# Altium project Servo-Driver.PrjPcb
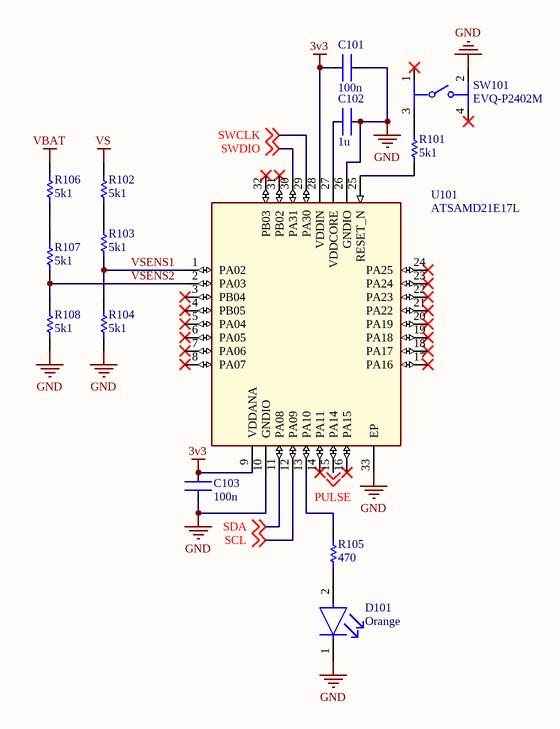
[diagram p0: SAMD21.SchDoc]
3 sheets, 29 parts. Net scope: global (net labels, ports and power ports of the same name join across sheets).
Board file: Main.PcbDoc
Sheets:
  SAMD21.SchDoc
  Power.SchDoc
  Ports.SchDoc

## Sheet SAMD21.SchDoc
size A3; SheetNumber: 1; SheetTotal: 3

### Parts
C101  100n  [FP-GCM155-0_05-MFG]
C102  1u  [FP-GRM155-0_1-MFG]
C103  100n  [FP-GCM155-0_05-MFG]
D101  Orange  [FP-SML-P1-MFG]
R101  5k1  [RESC1005X04N]
R102  5k1  [RESC1005X04N]
R103  5k1  [RESC1005X04N]
R104  5k1  [RESC1005X04N]
R105  470  [RESC1005X04N]
R106  5k1  [RESC1005X04N]
R107  5k1  [RESC1005X04N]
R108  5k1  [RESC1005X04N]
SW101  EVQ-P2402M  [EVQ-P2402M]
U101  ATSAMD21E17L  [QFN50P500X500X100_HS-33L]

### Nets
3v3: C101.1 C103.2 U101.9(VDDANA) U101.28(VDDIN)
GND: C101.2 C102.2 C103.1 D101.1(C) R104.1 R108.1 SW101.2 U101.10(GNDIO) U101.26(GNDIO) U101.33(EP)
VBAT: R106.2
VS: R102.2
PULSE: U101.15(PA14) ; off-sheet PULSE
SCL: U101.12(PA09) ; off-sheet SCL
SDA: U101.11(PA08) ; off-sheet SDA
SWCLK: U101.29(PA30) ; off-sheet SWCLK
SWDIO: U101.30(PA31) ; off-sheet SWDIO
VSENS1: R103.1 R104.2 U101.1(PA02)
VSENS2: R107.1 R108.2 U101.2(PA03)
NetC102_1: C102.1 U101.27(VDDCORE)
NetD101_2: D101.2(A) R105.2
NetR101_1: R101.1 SW101.3
NetR101_2: R101.2 U101.25(RESET_N)
NetR102_1: R102.1 R103.2
NetR105_1: R105.1 U101.13(PA10)
NetR106_1: R106.1 R107.2

Not connected (* = marked no-connect by the designer): SW101 1* 4*; U101 3(PB04)* 4(PB05)* 5(PA04)* 6(PA05)* 7(PA06)* 8(PA07)* 14(PA11)* 16(PA15)* 17(PA16)* 18(PA17)* 19(PA18)* 20(PA19)* 21(PA22)* 22(PA23)* 23(PA24)* 24(PA25)* 31(PB02)* 32(PB03)*

### Library data of the parts
C101 C103 = GCM155R71H104KE02J: Ceramic Capacitor for Automotive 100nF ±10% 50VDC X7R 0402 Paper T/R; Voltage Rating (DC): 50V; Case Code (Metric): 1005; Dielectric: X7R; Capacitance: 100nF; Packaging: Tape and Reel; Min Operating Temperature: -55°C; Length: 0.039inch; Thickness: 0.022inch; Height: 0.5mm; Mount: Surface Mount; Termination: SMD/SMT; Voltage Rating: 50V; Package Quantity: 50000; Width: 0.02inch; Case/Package: 0402; Case Code (Imperial): 0402; Ratings: AEC-Q200; Max Operating Temperature: 125°C; Tolerance: 10%; Weight: 0.000212oz; Supplier 1: Digi-Key; Supplier Part Number 1: 490-14514-1-ND
C102 = GRM155R61H105ME05D: Chip Multilayer Ceramic Capacitors for General Purpose, 0402, 1.0uF, X5R, 15%, 20%, 50V; Supplier 1: Digi-Key; Supplier Part Number 1: 490-GRM155R61H105ME05DTR-ND
D101 = SML-P11DTT86R: LED ORANGE CLEAR 1006 SMD; Manufacturer: Rohm; Forward Current: 1mA; Wavelength: 605nm; Reverse Voltage: 5V; Power Dissipation: 52mW; Led Orientation: Top View; Luminous Intensity: 7.3mcd; Forward Voltage: 1.9V; Mouser Description: LED Uni-Color Orange 2-Pin Chip 0402(1006Metric) T/R; RoHS: TRUE; Temperature: -40°C to +85°C; Package: SML-P11; Manufacturer Part Number: SML-P11DTT86R; Automotive: No; Digikey Description: LED ORANGE CLEAR 1006 SMD; Lead Free: Yes; Octopart: https://octopart.com/sml-p11dtt86r-rohm-34112313; Temperature Range Low: -40°C; Device Class L2: LEDs; Device Class L3: unset; Height: 0.25mm; Temperature Range High: +85°C; Device Class L1: Optoelectronics; ComponentLink2URL: https://d1d2qsbl8m0m72.cloudfront.net/en/products/databook/datasheet/opto/led/chip_mono/sml-p11-e.pdf; Colour: Orange; Category: Diode; ComponentLink2Description: Datasheet; Supplier 1: Digi-Key; Supplier Part Number 1: SML-P11DTT86RCT-ND
R101-R104 R106-R108 = ERJ-U02J512X: Manufacturer: Panasonic; Part Number: ERJ2RKF27R0X; Supplier 1: Mouser; Supplier Part Number 1: 667-ERJ-U02J512X
R105 = ERJ-U02J471X: Manufacturer: Panasonic; Part Number: ERJ2RKF27R0X; Supplier 1: Digi-Key; Supplier Part Number 1: 10-ERJ-U02J471XCT-ND
SW101 = EVQ-P2402M: Supplier 1: Digi-Key; Supplier Part Number 1: P11080SCT-ND
U101 = ATSAMD21E17L: Supplier 1: Arrow Electronics; Supplier Part Number 1: ATSAMD21E17L-MNT

## Sheet Power.SchDoc
size A; SheetNumber: 2; SheetTotal: 3
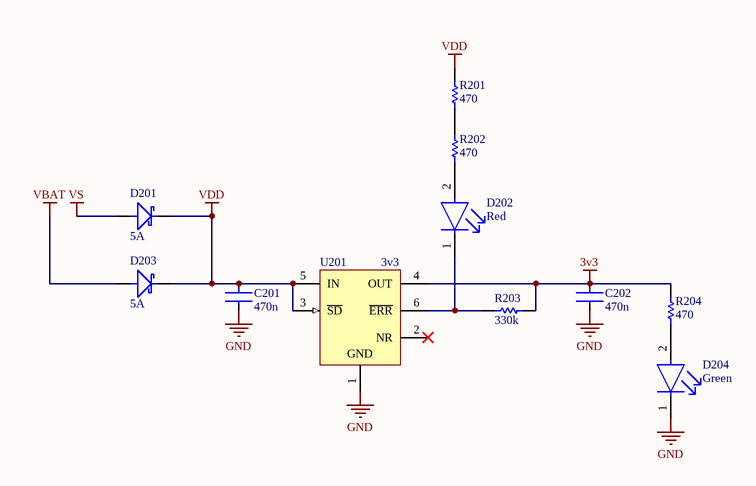
[diagram p1: Power.SchDoc]

### Parts
C201  470n  [FP-GRT155-0_05-MFG]
C202  470n  [FP-GRT155-0_05-MFG]
D201  5A  [SODFL470X105-2L]
D202  Red  [FP-SML-P1-MFG]
D203  5A  [SODFL470X105-2L]
D204  Green  [FP-SML-P1-MFG]
R201  470  [RESC1005X04N]
R202  470  [RESC1005X04N]
R203  330k  [RESC1005X04N]
R204  470  [RESC1005X04N]
U201  3v3  [SOT95P280X145-6L]

### Nets
3v3: C202.1 R203.1 R204.2 U201.4(OUT)
GND: C201.2 C202.2 D204.1(C) U201.1(GND)
VBAT: D203.2
VDD: C201.1 D201.1 D203.1 R201.2 U201.3(~{SD}) U201.5(IN)
VS: D201.2
NetD202_1: D202.1(C) R203.2 U201.6(~{ERR})
NetD202_2: D202.2(A) R202.1
NetD204_2: D204.2(A) R204.1
NetR201_1: R201.1 R202.2

Not connected (* = marked no-connect by the designer): U201 2(NR)*

### Library data of the parts
C201 C202 = GRT155R61E474KE01D: Multi-Layer Ceramic Capacitor 470nF 25V X5R ±10% 0402 Paper T/R; Tolerance: 10%; Packaging: Tape and Reel; Capacitance: 470nF; Case Code (Imperial): 0402; Ratings: AEC-Q200; Max Operating Temperature: 85°C; Case/Package: 0402; Length: 0.039inch; Width: 0.02inch; Case Code (Metric): 1005; Mount: Surface Mount; Voltage Rating: 25V; Thickness: 0.022inch; Min Operating Temperature: -55°C; Supplier 1: Digi-Key; Supplier Part Number 1: 490-12269-1-ND
D201 D203 = RB080LAM-30TR: Supplier 1: Digi-Key; Supplier Part Number 1: RB080LAM-30CT-ND
D202 = SML-P11UTT86R: LED RED CLEAR 1006 SMD; Manufacturer: Rohm; Wavelength: 621nm; Led Orientation: Top View; Luminous Intensity: 2.5mcd; Power Dissipation: 50mW; Forward Voltage: 1.8V; Reverse Voltage: 5V; Forward Current: 1mA; Manufacturer Part Number: SML-P11UTT86R; Device Class L2: LEDs; RoHS: TRUE; Device Class L1: Optoelectronics; Colour: Red; Lead Free: Yes; Height: 0.25mm; Automotive: No; Octopart: https://octopart.com/sml-p11utt86r-rohm-39058751; Temperature: -40°C to +85°C; Temperature Range Low: -40°C; Package: SML-P1; ComponentLink2URL: https://www.rohm.com/datasheet/SML-P11UT(R)/sml-p11-e; ComponentLink2Description: Datasheet; Category: Diode; Temperature Range High: +85°C; Device Class L3: unset; Mouser Description: Led, Picoled, Red, 621 Nm, 1.8 V, 1 Ma, 2.5 Mcd; Digikey Description: LED RED CLEAR 1006 SMD; Supplier 1: Digi-Key; Supplier Part Number 1: SML-P11UTT86RCT-ND
D204 = SML-P13PTT86R: LED GREEN CLEAR 1006 SMD; Manufacturer: Rohm; Power Dissipation: 52mW; Forward Current: 20mA; Reverse Voltage: 5V; Led Orientation: Top View; Forward Voltage: 2.1V; Luminous Intensity: 10mcd; Wavelength: 560nm; Temperature: -40°C to +85°C; Digikey Description: LED GREEN CLEAR 1006 SMD; Manufacturer Part Number: SML-P13PTT86R; Lead Free: Yes; Height: 0.25mm; Package: SML-P1; RoHS: TRUE; Mouser Description: LED Uni-Color Green 2-Pin Chip 0402(1006Metric) T/R; Device Class L2: LEDs; ComponentLink2URL: https://d1d2qsbl8m0m72.cloudfront.net/en/products/databook/datasheet/opto/led/chip_mono/sml-p1-e.pdf; Device Class L1: Optoelectronics; ComponentLink2Description: Datasheet; Category: Diode; Temperature Range High: +85°C; Automotive: No; Temperature Range Low: -40°C; Octopart: https://octopart.com/sml-p13ptt86r-rohm-59370256; Device Class L3: unset; Colour: Green; Supplier 1: Digi-Key; Supplier Part Number 1: 846-1197-1-ND
R201 R202 R204 = ERJ-U02J471X: as R105 on sheet SAMD21; Supplier 1: Digi-Key; Supplier Part Number 1: 10-ERJ-U02J471XCT-ND
R203 = ERJ-2GEJ334X: Manufacturer: Panasonic; Part Number: ERJ2RKF27R0X; Supplier 1: Digi-Key; Supplier Part Number 1: P330KJCT-ND
U201 = ADP3300ARTZ-3.3RL7: High Accuracy anyCAP(R) 50 mA Low Dropout Linear Regulator, 3 to 12 V Vin, 3.3 V Vout, Industrial, 6-pin SOT23 (RT-6), Reel; Manufacturer: Analog Devices; Supply Current IGND @ Small Load: 190uA; Vin (max) (V): 12; Iout max: 50mA; Vin (min) (V): 3; Preset Vout Values (V): 3.3; PackageReference: RT-6; Packing: Reel; ComponentLink2Description: Datasheet; ComponentLink4URL: Product URL:http://www.analog.com/en/ADP3300/productSearch.html; ComponentLink3Description: Package Specification; ComponentLink4Description: URL Link1; ComponentLink2URL: http://www.analog.com/static/imported-files/data_sheets/ADP3300.pdf; ComponentLink1URL: http://www.analog.com/en/index.html; PartNumber: ADP3300ARTZ-3.3RL7; Mounting Technology: Surface Mount; PackageDescription: 6-Pin Plastic Surface Mount SOT-23 Package, Body 2.9 x 1.65 mm, Pitch 0.95 mm; ComponentLink3URL: http://www.analog.com/static/imported-files/data_sheets/ADG465.pdf; PackageVersion: REV. A, 11/2006; ComponentLink1Description: Manufacturer URL; DatasheetVersion: Rev. B; Supplier 1: Digi-Key; Supplier Part Number 1: ADP3300ARTZ3.3RCT-ND

## Sheet Ports.SchDoc
size A; SheetNumber: 3; SheetTotal: 3
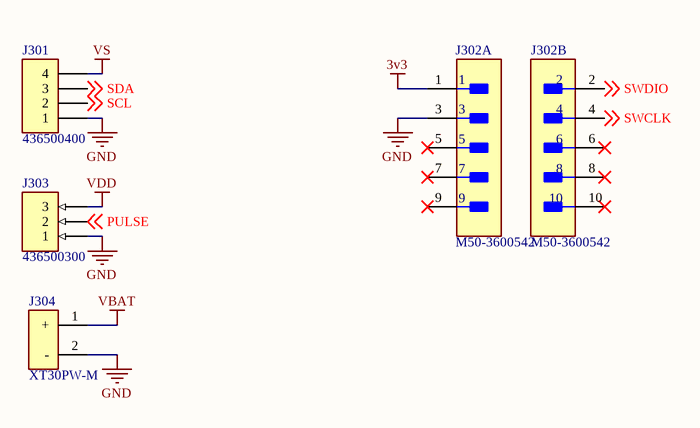
[diagram p2: Ports.SchDoc]

### Parts
J301  436500400  [436500400]
J302  M50-3600542  [FP-M50-3600542-MFG]  (parts A,B of 2)
J303  436500300  [436500300]
J304  XT30PW-M  [XT30PW-M]

### Nets
3v3: J302.1
GND: J301.1 J302.3 J303.1 J304.2(-)
VBAT: J304.1(+)
VDD: J303.3
VS: J301.4
PULSE: J303.2 ; off-sheet PULSE
SCL: J301.2 ; off-sheet SCL
SDA: J301.3 ; off-sheet SDA
SWCLK: J302.4 ; off-sheet SWCLK
SWDIO: J302.2 ; off-sheet SWDIO

Not connected (* = marked no-connect by the designer): J302 5* 6* 7* 8* 9* 10*

### Library data of the parts
J302 = M50-3600542: CONN HEADER SMD 10POS 1.27MM; Gender: Male; Insulation Resistance: 5GR; Row Spacing: 0.05inch; Number of Contacts: 10; Current Rating: 1A; Contact Resistance: 30mR; Length: 6.35mm; Mount: Surface Mount; Radiation Hardening: No; Contact Material: Copper Alloy; Material: Thermoplastic; Package Quantity: 1000; Contact Plating: Gold; Depth: 3.41mm; Contact Mating Length: 0.118inch; Number of Rows: 2; Pitch: 1.27mm; Packaging: Tray; Termination: Solder; Number of Positions: 10; Max Current Rating: 1A; Insulation Material: Thermoplastic; REACH SVHC: No SVHC; Min Operating Temperature: -40°C; Color: Black; Housing Material: Thermoplastic; Max Operating Temperature: 105°C; Orientation: Straight; Supplier 1: Digi-Key; Supplier Part Number 1: 952-1389-ND
J301 = 436500400: Supplier 1: Digi-Key; Supplier Part Number 1: WM1862-ND
J303 = 436500300: Supplier 1: Digi-Key; Supplier Part Number 1: WM1861-ND

## Nets that join several sheets
3v3: SAMD21 (C101.1 C103.2 U101.9 U101.28), Power (C202.1 R203.1 R204.2 U201.4), Ports (J302.1)
GND: SAMD21 (10 pins), Power (C201.2 C202.2 D204.1 U201.1), Ports (J301.1 J302.3 J303.1 J304.2)
VBAT: SAMD21 (R106.2), Power (D203.2), Ports (J304.1)
VDD: Power (6 pins), Ports (J303.3)
VS: SAMD21 (R102.2), Power (D201.2), Ports (J301.4)
PULSE: SAMD21 (U101.15), Ports (J303.2)
SCL: SAMD21 (U101.12), Ports (J301.2)
SDA: SAMD21 (U101.11), Ports (J301.3)
SWCLK: SAMD21 (U101.29), Ports (J302.4)
SWDIO: SAMD21 (U101.30), Ports (J302.2)